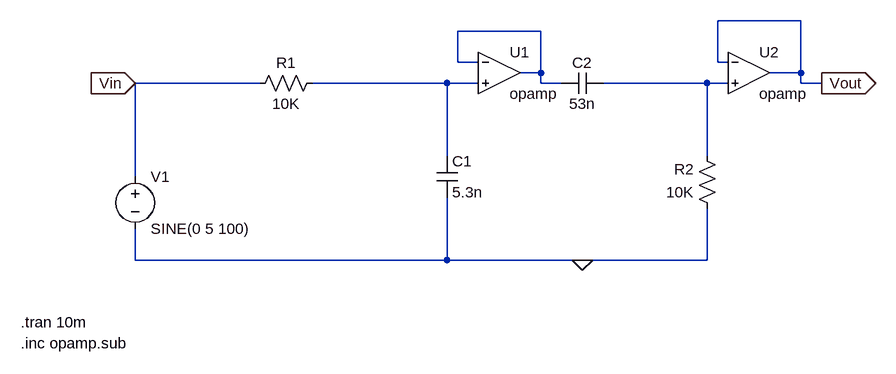
[diagram p0: schematic lab06-part2.asc]
lab06-part2.asc, the LTspice schematic file:
Version 4.1
SHEET 1 1088 680
WIRE 912 112 784 112
WIRE 512 128 384 128
WIRE 384 176 384 128
WIRE 416 176 384 176
WIRE 784 176 784 112
WIRE 800 176 784 176
WIRE 512 192 512 128
WIRE 512 192 480 192
WIRE 912 192 912 112
WIRE 912 192 864 192
WIRE 80 208 -112 208
WIRE 368 208 160 208
WIRE 416 208 368 208
WIRE 512 208 512 192
WIRE 544 208 512 208
WIRE 768 208 608 208
WIRE 800 208 768 208
WIRE 912 208 912 192
WIRE 944 208 912 208
WIRE 368 320 368 208
WIRE 768 320 768 208
WIRE -112 352 -112 208
WIRE -112 480 -112 432
WIRE 368 480 368 384
WIRE 368 480 -112 480
WIRE 576 480 368 480
WIRE 768 480 768 400
WIRE 768 480 576 480
FLAG 576 480 0
FLAG -112 208 Vin
IOPIN -112 208 In
FLAG 944 208 Vout
IOPIN 944 208 Out
SYMBOL voltage -112 336 R0
SYMATTR InstName V1
SYMATTR Value SINE(0 5 100)
SYMBOL res 176 192 R90
WINDOW 0 0 56 VBottom 2
WINDOW 3 32 56 VTop 2
SYMATTR InstName R1
SYMATTR Value 10K
SYMBOL res 784 416 R180
WINDOW 0 36 76 Left 2
WINDOW 3 36 40 Left 2
SYMATTR InstName R2
SYMATTR Value 10K
SYMBOL cap 352 320 R0
SYMATTR InstName C1
SYMATTR Value 5.3n
SYMBOL cap 608 192 R90
WINDOW 0 0 32 VBottom 2
WINDOW 3 32 32 VTop 2
SYMATTR InstName C2
SYMATTR Value 53n
SYMBOL OpAmps\\opamp 448 128 R0
SYMATTR InstName U1
SYMBOL OpAmps\\opamp 832 128 R0
SYMATTR InstName U2
TEXT -288 576 Left 2 !.tran 10m
TEXT -288 608 Left 2 !.inc opamp.sub

The netlist it stands for:
* lab06-part2.asc
V1 Vin 0 SINE(0 5 100)
R1 N002 Vin 10K
R2 0 N003 10K
C1 N002 0 5.3n
C2 N003 N001 53n
X§U1 N001 N002 N001 opamp Aol=100K GBW=10Meg  ; pins invin noninvin out
X§U2 Vout N003 Vout opamp Aol=100K GBW=10Meg  ; pins invin noninvin out
.tran 10m
.inc opamp.sub
.backanno
.end

* Results of the author's LTspice run, read from the files saved beside the schematic
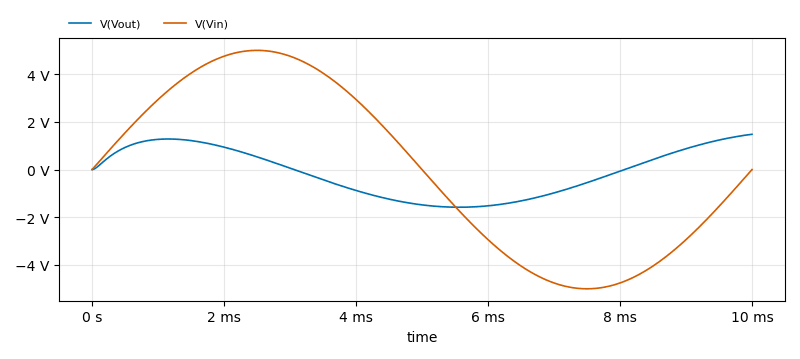
[diagram p1: Transient Analysis of lab06-part2.asc, plotted from the saved traces]
* Transient Analysis, 1 run:
*   V(Vout): min -1.579 V, max 1.481 V, average -87.29 mV, rms 1.027 V, last 1.481 V
*   V(Vin): min -5 V, max 5 V, average 0 V, rms 3.536 V, last 0 V